# EAGLE design MINI SSTC (EAGLE 9.6.1)
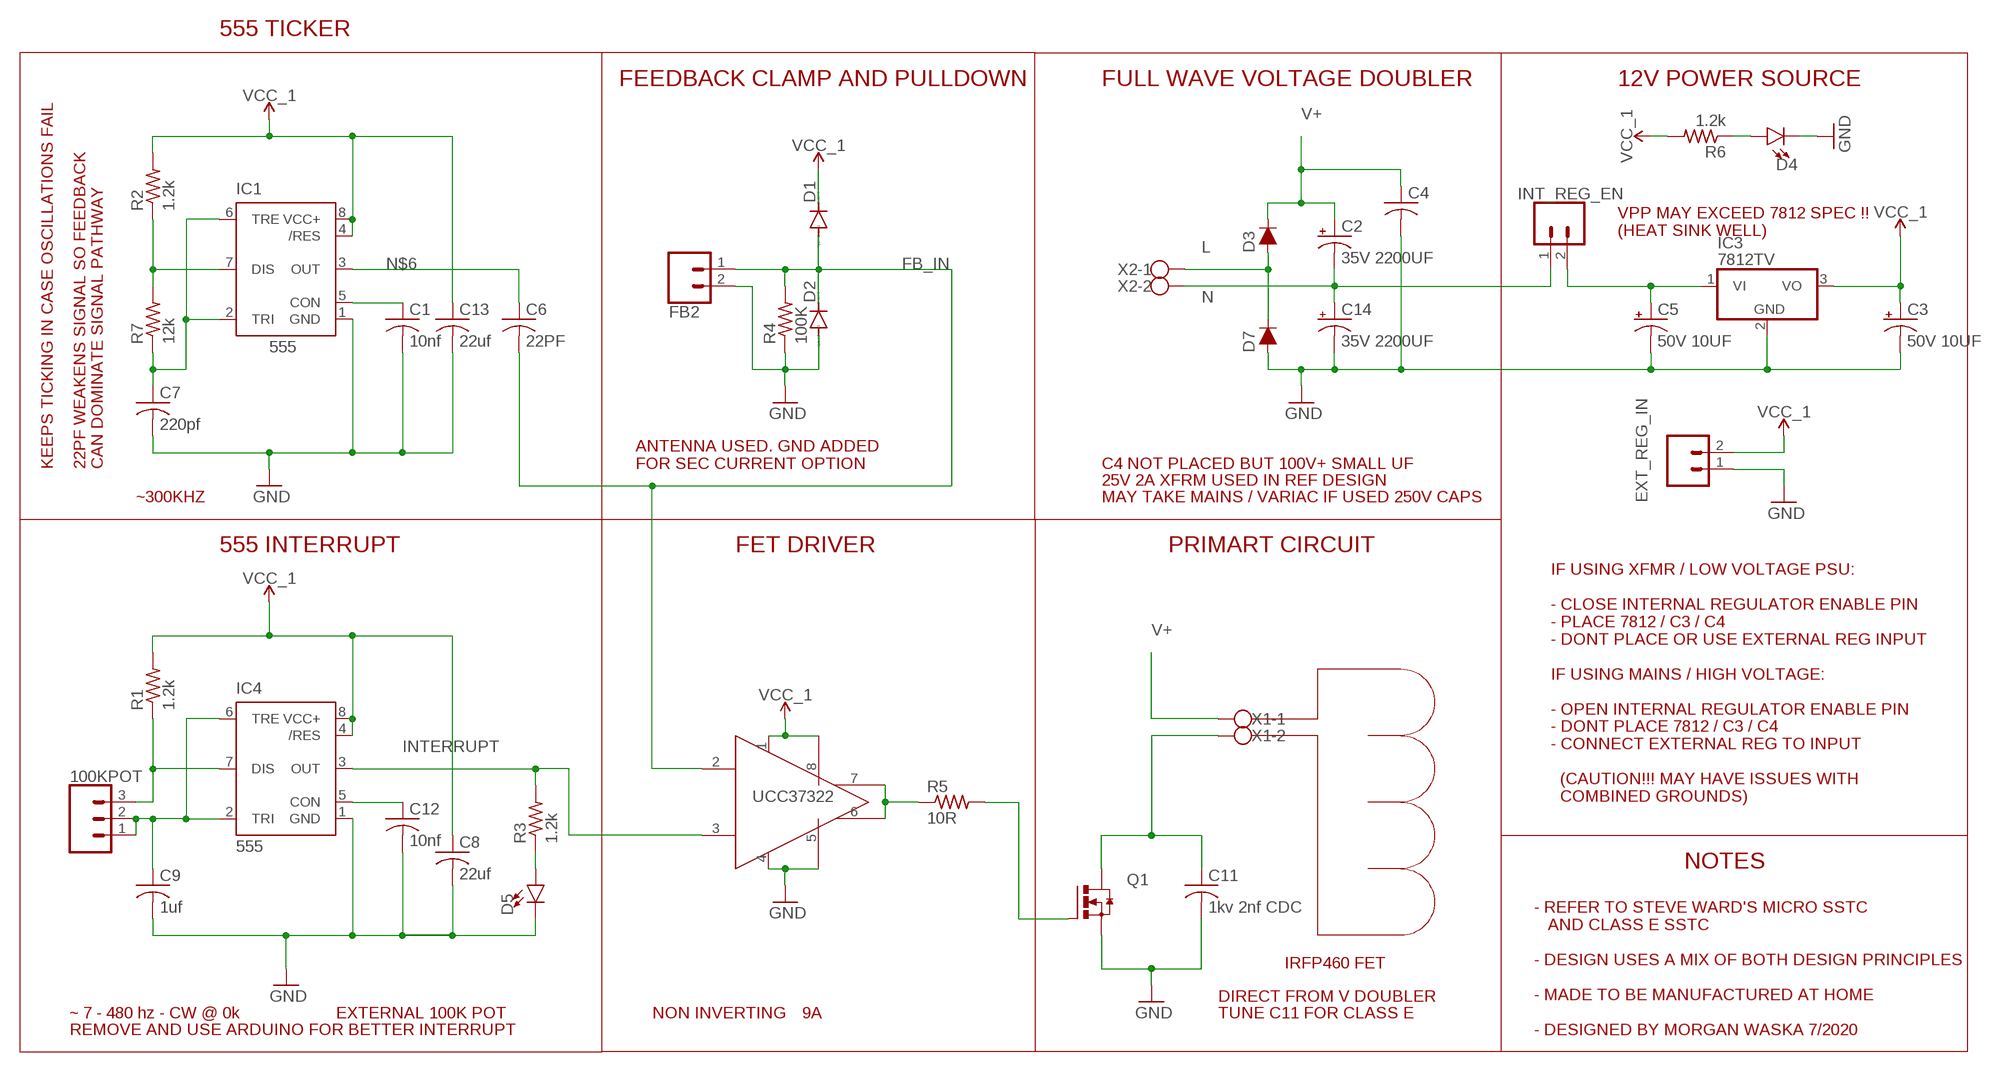
[diagram p0: schematic, sheet 1]

## Parts
100KPOT  455-1750-1-ND  CONN_03  [1X03]
C1  10nf  C-US025-040X050  [C025-040X050]
C2  35V 2200UF  CPOL-USE7.5-18  [E7,5-18]
C3  50V 10UF  CPOL-USE2.5-5  [E2,5-5]
C4  C-US025-040X050  [C025-040X050]
C5  50V 10UF  CPOL-USE2.5-5  [E2,5-5]
C6  22PF  C-US025-040X050  [C025-040X050]
C7  220pf  C-US025-040X050  [C025-040X050]
C8  22uf  C-US025-040X050  [C025-040X050]
C9  1uf  C-US025-040X050  [C025-040X050]
C11  1kv 2nf CDC  C-US150-054X183  [C150-054X183]
C12  10nf  C-US025-040X050  [C025-040X050]
C13  22uf  C-US025-040X050  [C025-040X050]
C14  35V 2200UF  CPOL-USE7.5-18  [E7,5-18]
D1  1N4148DO35-7  [DO35-7]
D2  1N4148DO35-7  [DO35-7]
D3  MUR460  DIODE-KIT2  [DIODE-1N4001-KIT]
D4  LED5MM  [LED_5MM]
D5  LED5MM  [LED_5MM]
D7  MUR460  DIODE-KIT2  [DIODE-1N4001-KIT]
EXT_REG_IN  CONN_02  [1X02]
FB2  CONN_02  [1X02]
IC1  555  555KIT  [DIP08-KIT]
IC2  UCC37322  UCC37321DIL8  [DIL08]
IC3  7812TV  [TO220V]
IC4  555  555KIT  [DIP08-KIT]
INT_REG_EN  CONN_02  [1X02]
Q1  IRFP460  IRFP240  [TO247BV]
R1  1.2k  R-US_0207/9  [0207/9]
R2  1.2k  R-US_0207/9  [0207/9]
R3  1.2k  R-US_0207/9  [0207/9]
R4  100K  R-US_0207/9  [0207/9]
R5  10R  R-US_0207/9  [0207/9]
R6  1.2k  R-US_0207/9  [0207/9]
R7  12k  R-US_0207/9  [0207/9]
X1  W237-102  [W237-102]
X2  W237-102  [W237-102]

## Nets
555CONA: C1.1 IC1.5(CON)
555CONB: C12.1 IC4.5(CON)
FB_IN: C6.2 D1.A D2.C FB2.1 IC2.2(2_IN) R4.2
GND: C1.2 C3.- C4.2 C5.- C7.2 C8.2 C9.2 C11.2 C12.2 C13.2 C14.- D2.A D4.K(C) D5.K(C) D7.A EXT_REG_IN.1 FB2.2 IC1.1(GND) IC2.4(4_AGND) IC2.5(5_PGND) IC3.2(GND) IC4.1(GND) Q1.S R4.1
INTERRUPT: IC2.3(3_ENBL) IC4.3(OUT) R3.2
L: D3.A D7.C X2.1
N: C2.- C14.+ INT_REG_EN.1 X2.2
N$1: Q1.G R5.2
N$2: D5.A R3.1
N$3: C11.1 Q1.D X1.2
N$4: D4.A R6.1
N$5: C5.+ IC3.1(VI) INT_REG_EN.2
N$6: C6.1 IC1.3(OUT)
N$8: IC2.6(6_OUT) IC2.7(7_OUT) R5.1
RR555A: IC1.7(DIS) R2.1 R7.2
RR555B: 100KPOT.3 IC4.7(DIS) R1.1
TRIG555A: C7.1 IC1.2(TRI) IC1.6(TRE) R7.1
TRIG555B: 100KPOT.1 100KPOT.2 C9.1 IC4.2(TRI) IC4.6(TRE)
V+: C2.+ C4.1 D3.C X1.1
VCC_1: C3.+ C8.1 C13.1 D1.C EXT_REG_IN.2 IC1.4(/RES) IC1.8(VCC+) IC2.1(1_VDD) IC2.8(8_VDD) IC3.3(VO) IC4.4(/RES) IC4.8(VCC+) R1.2 R2.2 R6.2

## Notes on the sheet
- 555 TICKER
- FEEDBACK CLAMP AND PULLDOWN | FULL WAVE VOLTAGE DOUBLER | 12V POWER SOURCE
- VPP MAY EXCEED 7812 SPEC !!
  (HEAT SINK WELL)
- KEEPS TICKING IN CASE OSCILLATIONS FAIL
- 22PF WEAKENS SIGNAL SO FEEDBACK
  CAN DOMINATE SIGNAL PATHWAY
- ANTENNA USED. GND ADDED 
  FOR SEC CURRENT OPTION
- C4 NOT PLACED BUT 100V+ SMALL UF
- 25V 2A XFRM USED IN REF DESIGN
- ~300KHZ | MAY TAKE MAINS / VARIAC IF USED 250V CAPS
- 555 INTERRUPT | FET DRIVER | PRIMART CIRCUIT
- UCC37322
- IF USING XFMR / LOW VOLTAGE PSU:
  
  - CLOSE INTERNAL REGULATOR ENABLE PIN
  - PLACE 7812 / C3 / C4
  - DONT PLACE OR USE EXTERNAL REG INPUT
  
  IF USING MAINS / HIGH VOLTAGE:
  
  - OPEN INTERNAL REGULATOR ENABLE PIN
  - DONT PLACE 7812 / C3 / C4
  - CONNECT EXTERNAL REG TO INPUT
  
    (CAUTION!!! MAY HAVE ISSUES WITH
    COMBINED GROUNDS)
- NOTES
- IRFP460 FET
- DIRECT FROM V DOUBLER
- ~ 7 - 480 hz - CW @ 0k | EXTERNAL 100K POT | NON INVERTING | 9A | TUNE C11 FOR CLASS E
- REMOVE AND USE ARDUINO FOR BETTER INTERRUPT
- - REFER TO STEVE WARD'S MICRO SSTC
     AND CLASS E SSTC
  
  - DESIGN USES A MIX OF BOTH DESIGN PRINCIPLES
  
  - MADE TO BE MANUFACTURED AT HOME
  
  - DESIGNED BY MORGAN WASKA 7/2020

## Library data of the parts
100KPOT = SparkFun-Connectors:CONN_03: Multi connection point. Often used as Generic Header-pin footprint for 0.1 inch spaced/style header connections On any of the 0.1 inch spaced packages, you can populate with these: Break Away Headers - Straight <https://www.sparkfun.com/products/116> (PRT-00116) Break Away Male Headers - Right Angle <https://www.sparkfun.com/products/553> (PRT-00553) Female Headers <https://www.sparkfun.com/products/115> (PRT-00115) Break Away Headers - Machine Pin <https://www.sparkfun.com/products/117> (PRT-00117) Break Away Female Headers - Swiss Machine Pin <https://www.sparkfun.com/products/743> (PRT-00743) Stackable Header - 3 Pin (Female, 0.1") <https://www.sparkfun.com/products/13875> (PRT-13875) For SCREWTERMINALS and SPRING TERMINALS visit here: Screw Terimnals on SparkFun.com <https://www.sparkfun.com/search/results?term=Screw+Terminals> (5mm/3.5mm/2.54mm spacing) This device is also useful as a general connection point to wire up your design to another part of your project. Our various solder wires solder well into these plated through hole pads. Hook-Up Wire - Assortment (Stranded, 22 AWG) <https://www.sparkfun.com/products/11375> (PRT-11375) Hook-Up Wire - Assortment (Solid Core, 22 AWG) <https://www.sparkfun.com/products/11367> (PRT-11367) View the entire wire category on our website here <https://www.sparkfun.com/categories/141> Special notes: Molex polarized connector foot print use with SKU : PRT-08232 with associated crimp pins and housings.; PROD_ID: XXX-00000
C1 C4 C6-C9 C11-C13 = adafruit:C-US: CAPACITOR, American symbol
C2 C3 C5 C14 = adafruit:CPOL-US: POLARIZED CAPACITOR, American symbol
D1 D2 = diode:1N4148: DIODE high speed (Philips)
D3 D7 = SparkFun-DiscreteSemi:DIODE: Diode These are standard reverse protection diodes and small signal diodes. SparkFun Products: SparkFun SparkPunk Sound Kit <https://www.sparkfun.com/products/11177> SparkFun ESP8266 Thing <https://www.sparkfun.com/products/13231>; PROD_ID: DIO-09176; VALUE: 1A/50V/1.1V
D4 D5 = SparkFun-LED:LED: LED (Generic) Standard schematic elements and footprints for 5mm, 3mm, 1206, and 0603 sized LEDs. Generic LEDs with no color specified.
EXT_REG_IN FB2 INT_REG_EN = SparkFun-Connectors:CONN_02: Multi connection point. Often used as Generic Header-pin footprint for 0.1 inch spaced/style header connections On any of the 0.1 inch spaced packages, you can populate with these: Break Away Headers - Straight <https://www.sparkfun.com/products/116> (PRT-00116) Break Away Male Headers - Right Angle <https://www.sparkfun.com/products/553> (PRT-00553) Female Headers <https://www.sparkfun.com/products/115> (PRT-00115) Break Away Headers - Machine Pin <https://www.sparkfun.com/products/117> (PRT-00117) Break Away Female Headers - Swiss Machine Pin <https://www.sparkfun.com/products/743> (PRT-00743) For SCREWTERMINALS and SPRING TERMINALS visit here: Screw Terimnals on SparkFun.com <https://www.sparkfun.com/search/results?term=Screw+Terminals> (5mm/3.5mm/2.54mm spacing) This device is also useful as a general connection point to wire up your design to another part of your project. Our various solder wires solder well into these plated through hole pads. Hook-Up Wire - Assortment (Stranded, 22 AWG) <https://www.sparkfun.com/products/11375> (PRT-11375) Hook-Up Wire - Assortment (Solid Core, 22 AWG) <https://www.sparkfun.com/products/11367> (PRT-11367) View the entire wire category on our website here <https://www.sparkfun.com/categories/141> Special notes: Molex polarized connector foot print use with: PRT-08233 with associated crimp pins and housings. 2.54_SCREWTERM for use with PRT-10571. 3.5mm Screw Terminal footprints for PRT-08084 5mm Screw Terminal footprints for use with PRT-08432
IC1 IC4 = SparkFun-IC-Special-Function:555: General purpose bipolar Timer Datasheet <http://www.sparkfun.com/datasheets/Components/General/ne555.pdf> SparkFun Products SparkFun SparkPunk Sequencer Kit <https://www.sparkfun.com/products/12707> (KIT-12707) Storefront Component: 555 Timer <https://www.sparkfun.com/products/9273> (COM-09273) Two parts valid for production: VFP: IC-11930 (M7555 PTH) VFP: IC-09173 (555 PTH) - Preferred; PROD_ID: IC-09173; PROD_ID_ALT: IC-11930
IC2 = ucc37321:UCC37321: NonInverting 9A Mosfet Gate Diver with Enable
IC3 = linear:78*: Positive VOLTAGE REGULATOR Source: http://cache.national.com/ds/LM/LM78L05.pdf http://www.fairchildsemi.com/ds/LM/LM7805.pdf
Q1 = transistor-power:IRFP240: HEXFET Power MosFet Source: http://www.irf.com/
R1-R7 = adafruit:R-US_: RESISTOR, American symbol
X1 X2 = con-wago-500:W237-102: WAGO SCREW CLAMP; MPN: 237-102; OC_FARNELL: unknown; OC_NEWARK: 70K9898

## Board
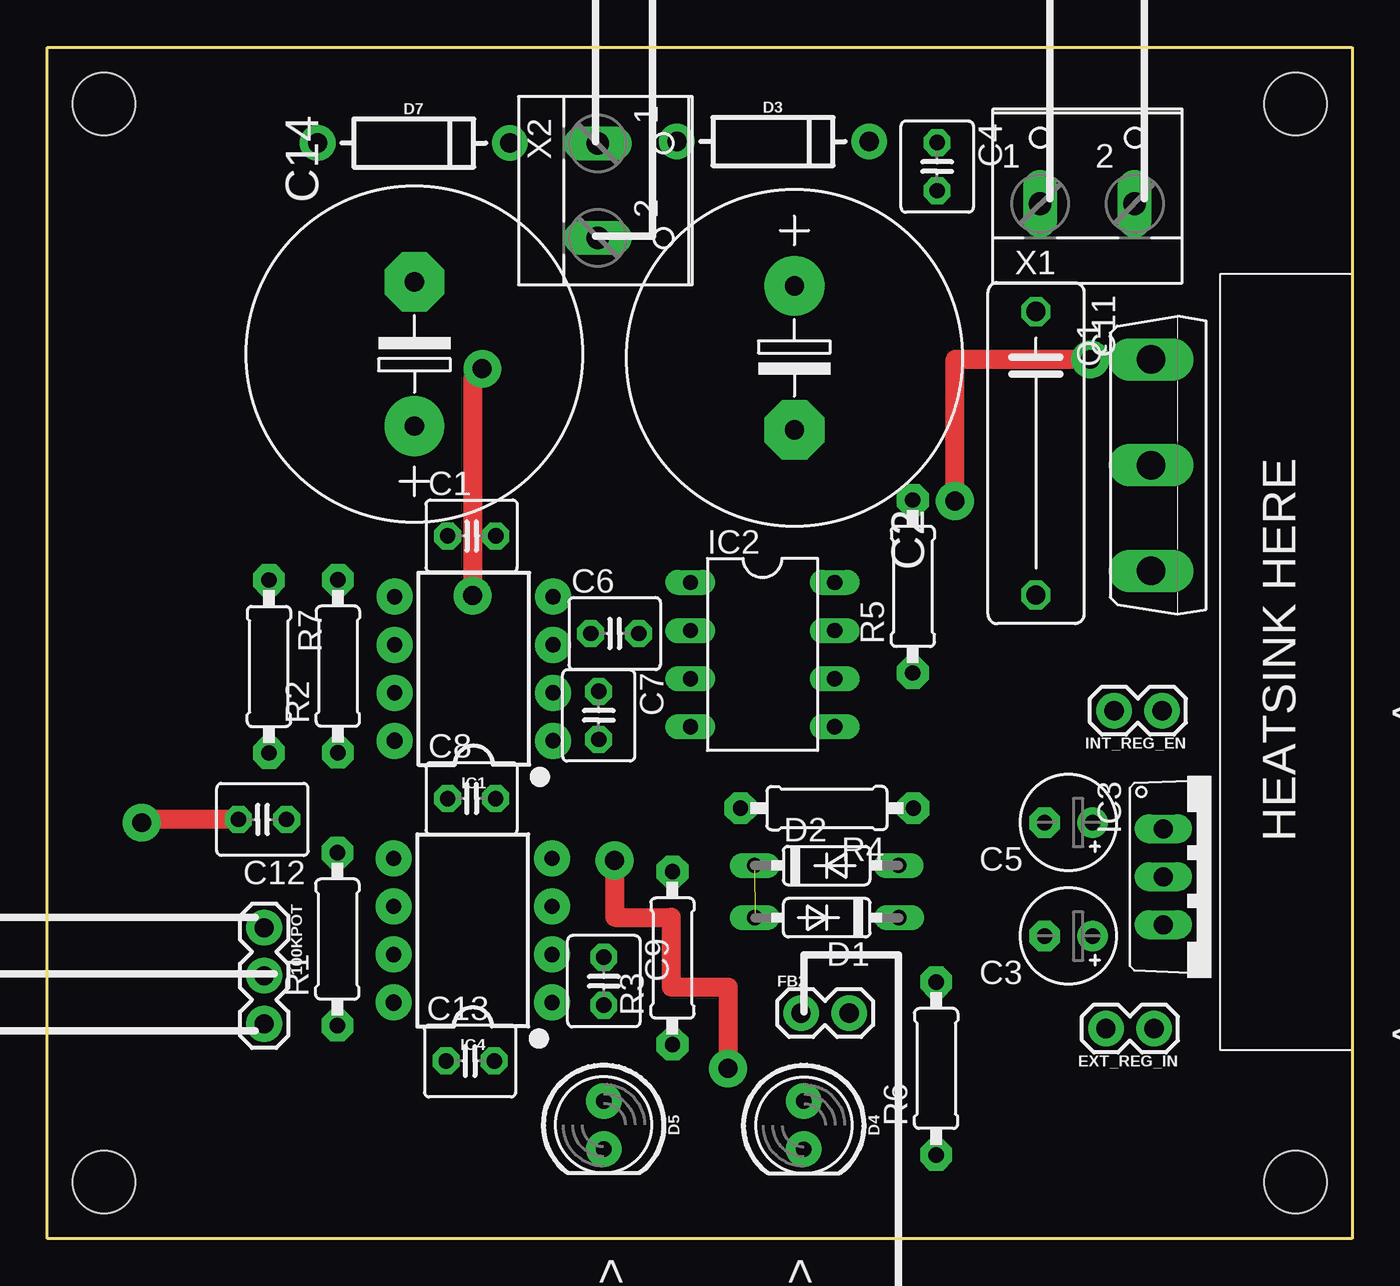
[diagram p1: board, top side]
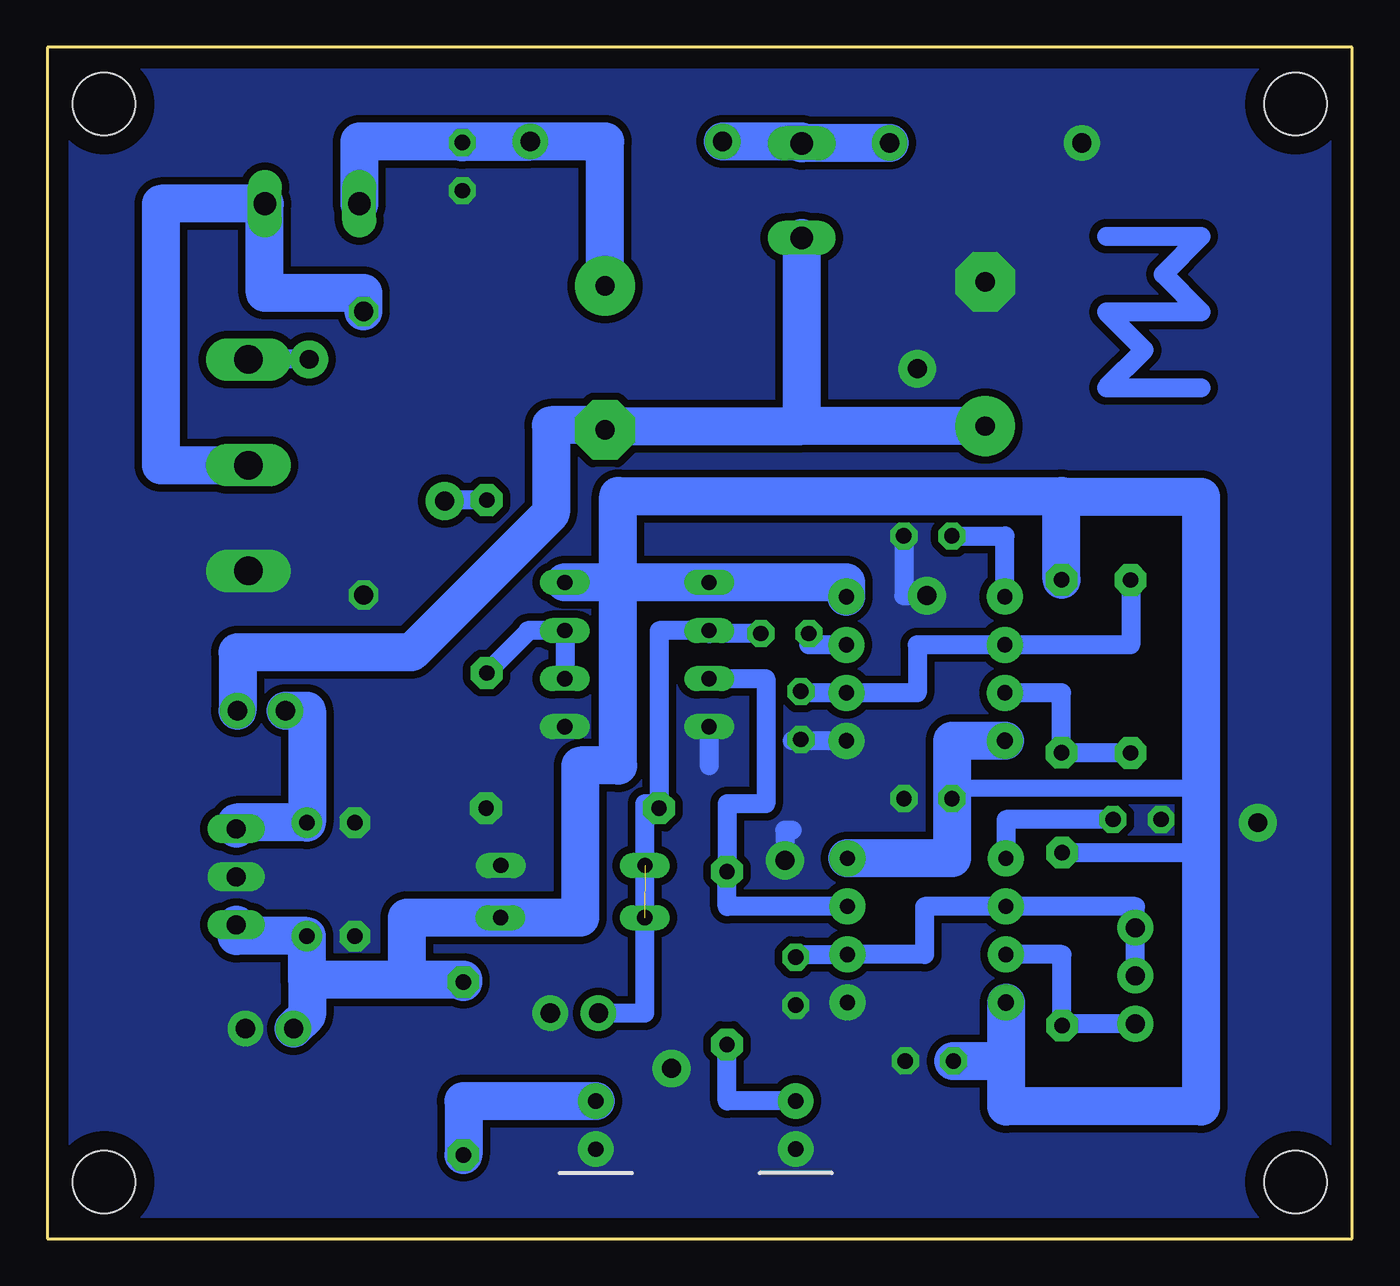
[diagram p2: board, bottom side, seen from below]

Size 69 x 63 mm. Coordinates in mm from the lower left corner, seen from the top.
Outline: 0,0 0,63 69,63 69,0 0,0
Copper layers (1*16): Top 0.035mm / dielectric 1.5mm / Bottom 0.035mm
Design rules "default *": minimum track width 16mil, minimum drill 0.35mm, track to track 0.4mm, track to pad 0.4mm, pad to pad 0.4mm, via to via 0.4mm, smd to smd 0.4mm, copper to edge 40mil, drill to drill 6mil, minimum pad ring 10mil, minimum via ring 8mil, stop-mask expansion 4mil, vias tented up to drill 0mil, thermal gap 0mil
Holes 3.3 mm at 3,60 3,3 66,3 66,60

### Footprints (pad centres in the part's own frame; a part is rotated, then mirrored left to right if it is on the bottom)
1X03 = drill 1.016 pad 1.88: 1 0,0; 2 2.54,0; 3 5.08,0
C025-040X050 = drill 0.813 pad 1.422 octagon: 1 -1.27,0; 2 1.27,0
E7,5-18 = drill 1.016 pad 3.15: + -3.81,0 | drill 1.016 pad 3.15 octagon: - 3.81,0
E2,5-5 = drill 0.813 pad 1.6: + -1.27,0 | drill 0.813 pad 1.6 octagon: - 1.27,0
C150-054X183 = drill 1.016 octagon: 1 -7.493,0; 2 7.493,0
DO35-7 = drill 0.813 long: A 3.81,0; C -3.81,0
DIODE-1N4001-KIT = drill 1.016 pad 1.88: A -5.08,0; C 5.08,0
LED_5MM = drill 0.813 pad 1.88: A -1.27,0; K 1.27,0
1X02 = drill 1.016 pad 1.88: 1 0,0; 2 2.54,0
DIP08-KIT = drill 0.813 pad 1.905: 1 -3.81,-4.191; 2 -1.27,-4.191; 3 1.27,-4.191; 4 3.81,-4.191; 5 3.81,4.191; 6 1.27,4.191; 7 -1.27,4.191 | drill 0.864 pad 1.905: 8 -3.81,4.191
DIL08 = drill 0.813 long: 1 -3.81,-3.81; 2 -1.27,-3.81; 3 1.27,-3.81; 4 3.81,-3.81; 5 3.81,3.81; 6 1.27,3.81; 7 -1.27,3.81; 8 -3.81,3.81
TO220V = drill 1.016 long: 1 -2.54,-2.54; 2 0,-2.54; 3 2.54,-2.54
TO247BV = drill 1.499 long: D 0,-2.921; G -5.588,-2.921; S 5.588,-2.921
0207/9 = drill 0.813 pad 1.676 octagon: 1 -4.572,0; 2 4.572,0
W237-102 = drill 1.194 long: 1 -2.5,-1.27; 2 2.5,-1.27

### Placement (x,y rotation side)
100KPOT  11.47,16.44 270 top
C1  22.44,37.16 0 top
C2  39.51,46.58 270 top
C3  54,16 180 top
C4  47.05,56.69 270 top
C5  54,22 180 top
C6  30,32 0 top
C7  29.15,27.67 270 top
C8  22.43,23.28 0 top
C9  29.43,13.62 270 top
C11  52.28,41.54 270 top
C12  11.38,22.17 180 top
C13  22.36,9.4 0 top
C14  19.41,46.78 90 top
D1  41.22,16.97 180 top
D2  41.21,19.74 0 top
D3  38.37,58.02 0 top
D4  40,6 270 top
D5  29.42,6.02 270 top
D7  19.37,57.94 0 top
EXT_REG_IN  58.52,11.11 180 top
FB2  39.86,11.93 0 top
IC1  22.55,30.14 90 top
IC2  37.82,30.89 270 top
IC3  61.55,19.13 270 top
IC4  22.5,16.3 90 top
INT_REG_EN  58.94,27.92 180 top
Q1  61.28,40.9 270 top
R1  15.34,15.84 90 top
R2  15.37,30.27 90 top
R3  33.06,14.84 90 top
R4  41.22,22.76 180 top
R5  45.77,34.49 90 top
R6  47,9 90 top
R7  11.72,30.26 270 top
X1  55,56 0 top
X2  30.37,55.42 270 top

### Tracks (layer width: path | path; a pad name or v marks a point on that pad's centre or on a via)
555CONA
  Bottom 1: IC1.5 18.36,37.16 C1.1
555CONB
  Bottom 1: IC4.5 18.31,22.17 C12.1
FB_IN  (1 unrouted)
  Bottom 1: FB2.1 37.4,11.93 D2.C 37.4,23 36.65,23 R4.2 36.65,32.16 IC2.2 34.01,32 C6.2
GND  (via drill 1 pad 2)
  Top 1: C12.2 5,22.17 v5,22 | v23,46 22.49,45.49 v22.49,34 | v30,20 30,17 32.99,17 32.99,13.31 36,13.31 v36,9
  Bottom 1: IC2.4 34,25 | C1.2 23.71,34 v22.49,34 | IC1.1 29.6,26.33 | 29.6,21.6 30,21.6 v30,20
  pour Bottom: 1,62 68,62 68,1 1,1
INTERRUPT
  Bottom 1: IC2.3 31,29.62 31,23 33.06,23 R3.2 33.06,17.57 IC4.3
L
  Bottom 2: D7.C 29.1,57.94 X2.1 29.1,58.02 D3.A
N
  Bottom 2: INT_REG_EN.1 58.94,31 49.75,31 42.37,38.38 42.37,43.02 39.76,43.02 C2.- 39.3,42.97 29.1,42.97 | C14.+ 29.1,42.97 | 29.1,42.97 X2.2
N$1  (via drill 1 pad 2)
  Top 1: v48,39 48,46.5 v55.15,46.5
  Bottom 1: R5.2 48,39.06 v48,39 | v55.15,46.5 Q1.G
N$2
  Bottom 1: D5.A 33.06,7.29 R3.1
N$3
  Bottom 2: Q1.D 63,40.9 63,54.73 X1.2 57.5,50 52.28,50 C11.1
N$4
  Bottom 2: D4.A 47,7.27 R6.1
N$5
  Bottom 2: IC3.1 59.01,22 C5.+ 55.27,27.92 INT_REG_EN.2
N$6
  Bottom 1: IC1.3 28.73,31.41 C6.1
N$7
  Bottom 1.016: 13,53 8,53 10,51 8,49 13,49 11,47 13,45 8,45
N$8
  Bottom 1: IC2.6 IC2.7 43.6,32.16 43.6,32.09 R5.1
RR555A
  Bottom 1: R7.2 15.37,25.69 R2.1 15.37,28.87 IC1.7
RR555B
  Bottom 1: 100KPOT.3 15.34,11.36 R1.1 15.34,15.03 IC4.7
TRIG555A
  Bottom 1: R7.1 11.72,31.41 IC1.6 23,31.41 23,28.87 IC1.2 29.15,28.87 C7.1
TRIG555B
  Bottom 1: 100KPOT.2 100KPOT.1 11.47,17.57 IC4.6 22.62,17.57 22.62,15.03 IC4.2 29.28,15.03 C9.1
V+
  Bottom 2: X1.1 52.5,58.02 D3.C | C2.+ 39.51,58.02 D3.C | C4.1 47.05,58.02 D3.C
VCC_1
  Bottom 0.9: C8.1 21.05,23.28 21.05,23.83 8,23.83 8,24
  Bottom 1: IC2.1 38.82,34.7 | 38.82,34.7 IC2.8 | 38.82,39.13 38.82,34.7 | IC4.8 18.7,12.11 | C13.1 20.79,9.7 | R1.2 8,20.41 8,24
  Bottom 2: IC3.3 59.01,16 C3.+ 55.27,13.7 | 50,13.7 55.27,13.7 | 50,13.7 50,16.97 D1.C 40.82,16.97 40.82,25.02 38.82,25.02 38.82,39.13 38.82,39.27 15.37,39.27 15.37,39.24 | 55.27,13.7 55.27,11.82 EXT_REG_IN.2 | 15.37,39.24 8,39.24 8,23.05 8,23.04 8,21.3 8,21.29 8,20.41 8,7 18.31,7 18.31,9.4 | IC2.8 26.75,34.7 IC1.4 | R2.2 15.37,39.24 | IC4.8 18.31,9.4 | C13.1 18.31,9.4 | R6.2 47,13.7 50,13.7 | IC1.8 21.16,26.33 C8.1 21.16,20.11 IC4.4

### Text on the board
tPlace: 120VAC MAINS | USE ORANGE WIRE IF 240V !! | BLACK | WHITE | UL 1585 | 24V 40VA | TRANSFORMER | PRIMARY COIL | TRANSFORMER IS ~45VPP / / - EXCEEDS BUS CAP SPEC / - EXCEEDS LM7812 SPEC / / STILL WORKS - BUT BE / CAREFUL IF USING THIS XFMR | PLAY WITH PRIMARY TURNS. / ~3 - 8 DEPENDING ON SECONDARY DESIGN | NOTES: / / - ONLY BOTTOM LAYER USED / - TOP LAYER MUST BE JUMPERED WITH WIRE / - MILLED OUT USING AN ANT PCB MILL / - HEATSINK ACROSS MOSFET AND 7812 / - | < --- CLOSE JUMPER | HEATSINK HERE | < --- OPEN JUMPER | INTERRUPTER | 100K POTENTIOMETER | < -- INTERRUPT LED | < -- POWER LED | 80MM WIRE ANTENNA / PLAY WITH LENGTH AND PLACEMENT | ANTENNA